# EAGLE schematic 85 SOP8 v2 (EAGLE 9.3.1)
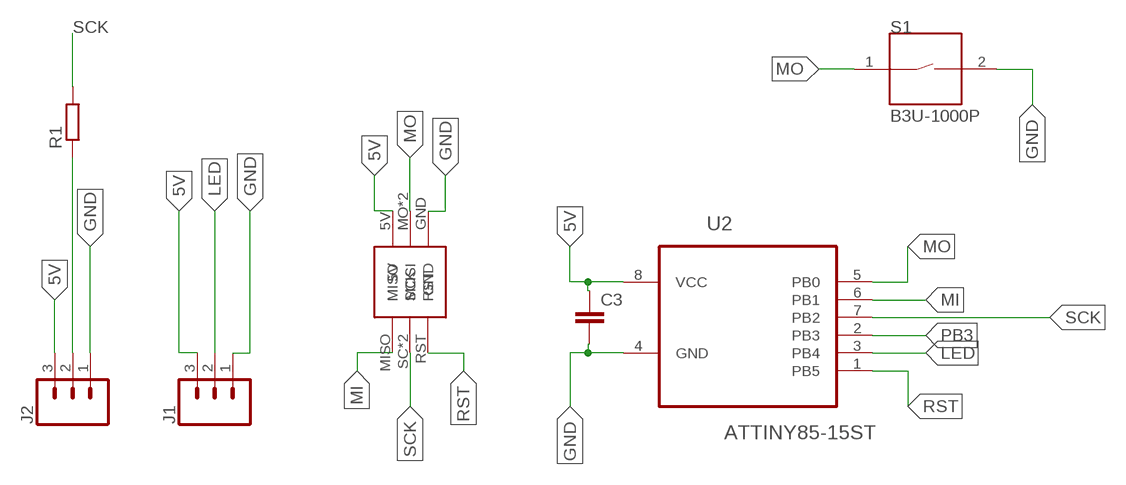
[diagram p0: schematic, sheet 1]

## Parts
C3  C-EUC0603  [C0603]
J1  CONN_031X03_NO_SILK  [1X03_NO_SILK]
J2  CONN_031X03_NO_SILK  [1X03_NO_SILK]
R1  R-EU_R0603  [R0603]
S1  B3U-1000P  [SW_B3U-1000P]
U2  ATTINY85-15ST  [SOIC127P798X216-8N]
U$1  ISCP_PORTPOGONEW  [ISCP_PADS_2ROW2HNEW]

## Nets
5V: C3.1 J1.3 J2.3 U2.8(VCC) U$1.5V
GND: C3.2 J1.1 J2.1 S1.2 U2.4(GND) U$1.GND
LED: J1.2 U2.3(PB4)
MI: U2.6(PB1) U$1.MISO
MO: S1.1 U2.5(PB0) U$1.MO(MOSI) U$1.MOSI
N$1: J2.2 R1.1
PB3: U2.2(PB3)
RST: U2.1(PB5) U$1.RST
SCK: R1.2 U2.7(PB2) U$1.SC(SCK) U$1.SCK

## Library data of the parts
C3 = resistor:C-EU: CAPACITOR, European symbol
J1 J2 = SparkFun-Connectors:CONN_03: Multi connection point. Often used as Generic Header-pin footprint for 0.1 inch spaced/style header connections On any of the 0.1 inch spaced packages, you can populate with these: Break Away Headers - Straight <https://www.sparkfun.com/products/116> (PRT-00116) Break Away Male Headers - Right Angle <https://www.sparkfun.com/products/553> (PRT-00553) Female Headers <https://www.sparkfun.com/products/115> (PRT-00115) Break Away Headers - Machine Pin <https://www.sparkfun.com/products/117> (PRT-00117) Break Away Female Headers - Swiss Machine Pin <https://www.sparkfun.com/products/743> (PRT-00743) Stackable Header - 3 Pin (Female, 0.1") <https://www.sparkfun.com/products/13875> (PRT-13875) For SCREWTERMINALS and SPRING TERMINALS visit here: Screw Terimnals on SparkFun.com <https://www.sparkfun.com/search/results?term=Screw+Terminals> (5mm/3.5mm/2.54mm spacing) This device is also useful as a general connection point to wire up your design to another part of your project. Our various solder wires solder well into these plated through hole pads. Hook-Up Wire - Assortment (Stranded, 22 AWG) <https://www.sparkfun.com/products/11375> (PRT-11375) Hook-Up Wire - Assortment (Solid Core, 22 AWG) <https://www.sparkfun.com/products/11367> (PRT-11367) View the entire wire category on our website here <https://www.sparkfun.com/categories/141> Special notes: Molex polarized connector foot print use with SKU : PRT-08232 with associated crimp pins and housings.
R1 = resistor:R-EU_: RESISTOR, European symbol
S1 = B3U-1000P:B3U-1000P: Switch Tactile N.O. SPST Round Button Gull Wing 0.05A 12VDC 1.5N SMD Embossed T/R; AVAILABILITY: Unavailable; DESCRIPTION: Switch Tactile N.O. SPST Round Button Gull Wing 0.05A 12VDC 1.5N SMD Embossed T/R; MF: Omron; MP: B3U-1000P; PACKAGE: None; PRICE: None
U2 = ATTINY85-15ST:ATTINY85-15ST: 8-bit Microcontroller with In-System Programmable Flash; AVAILABILITY: Unavailable; DESCRIPTION: MCU 8-bit ATtiny AVR RISC 8KB Flash 3.3V/5V 8-Pin SOIC; MF: Microchip; MP: ATTINY85-15ST; PACKAGE: SOIC-8 Microchip; PRICE: None
U$1 = CoreDuino:ISCP_PORT